# EAGLE design Driver_TS_switch_latch (EAGLE 9.2.2)
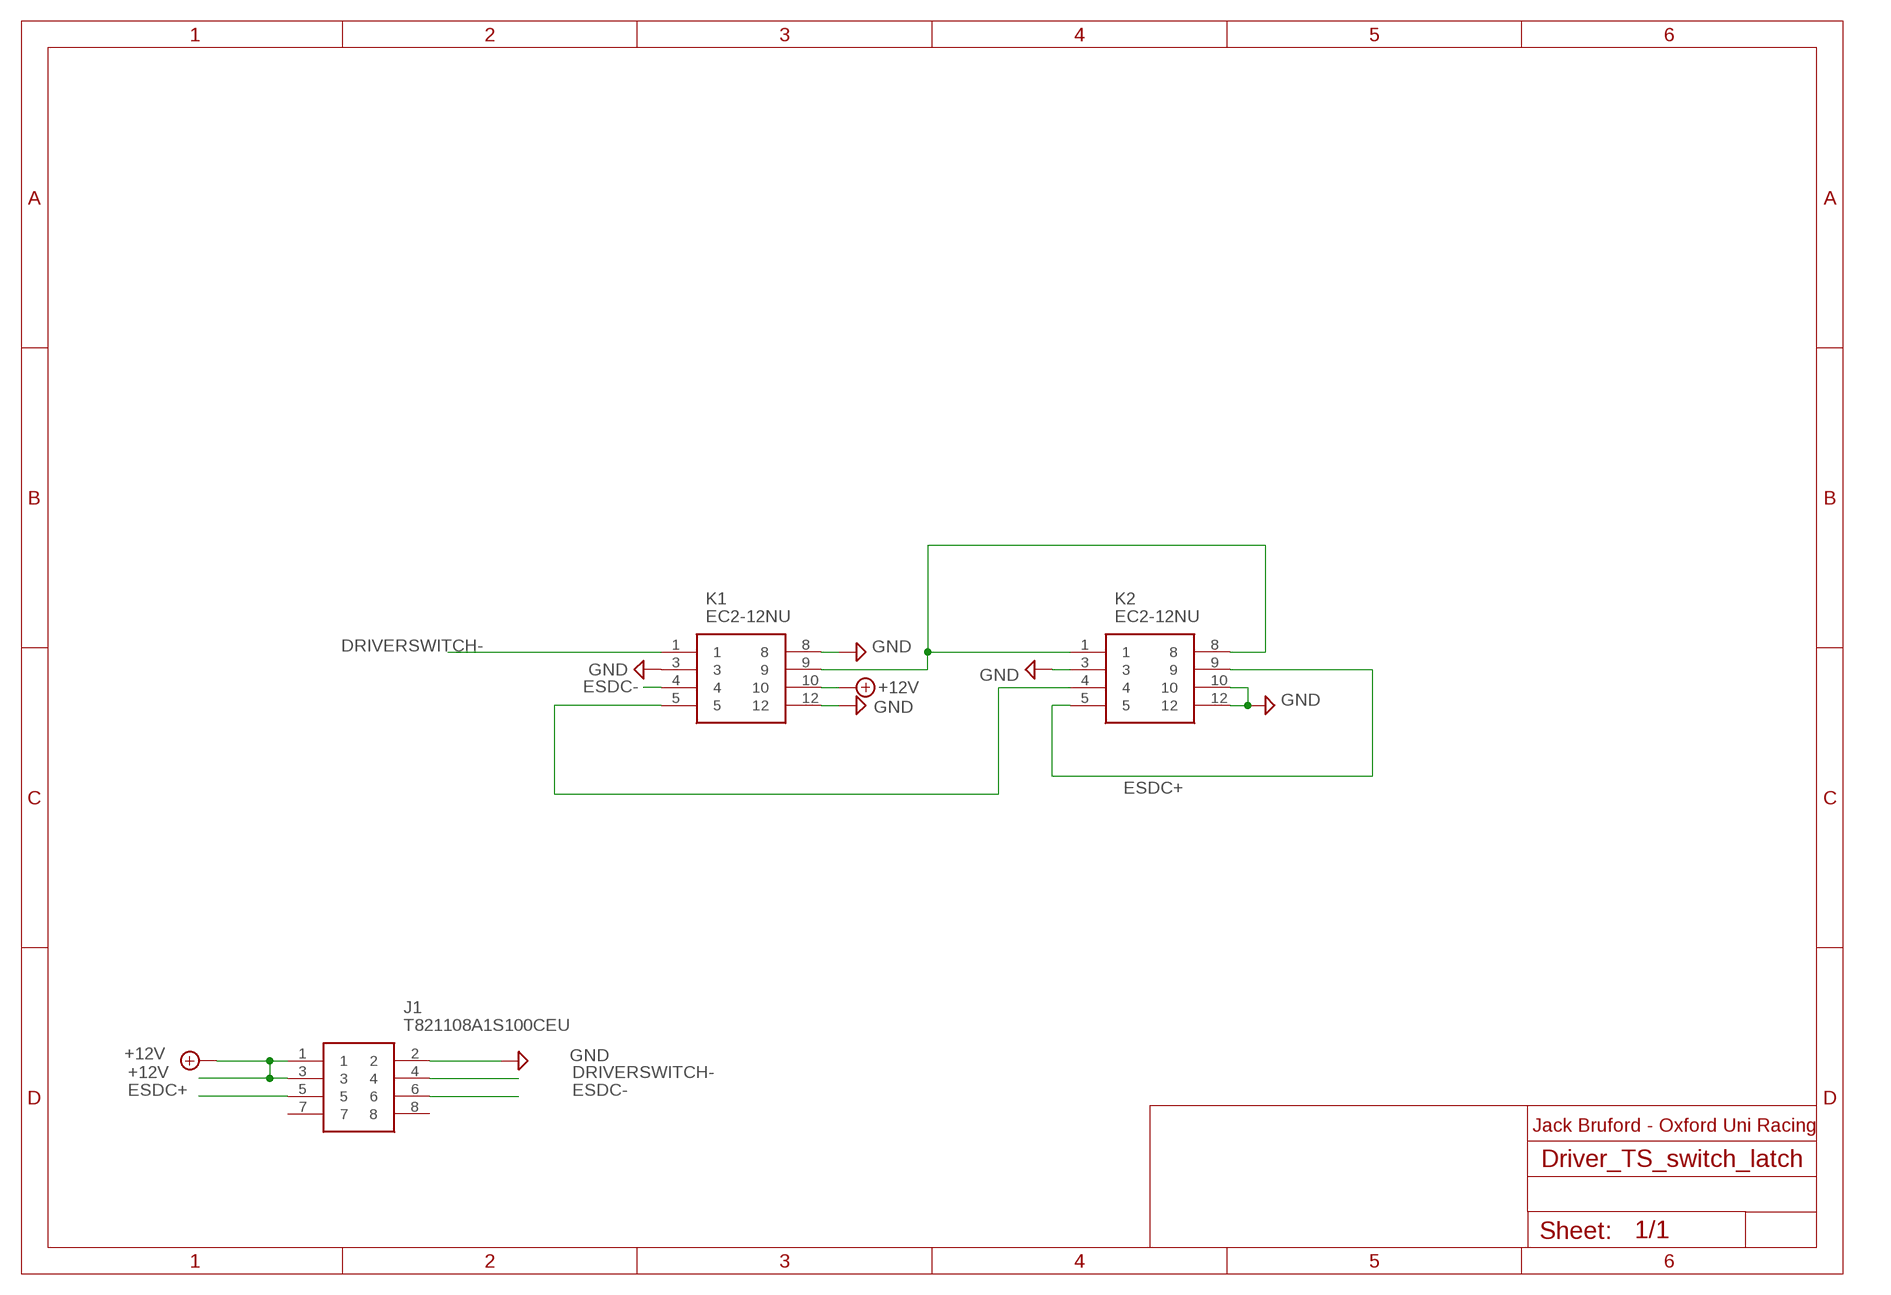
[diagram p0: schematic, sheet 1]

## Parts
J1  T821108A1S100CEU  [HDRV8W64P254_2X4_1778X895X915P]
K1  EC2-12NU  [EC2-12NU]
K2  EC2-12NU  [EC2-12NU]

## Nets
+12V: J1.1 J1.3 K1.10
DRIVERSWITCH-: J1.4 K1.1
ESDC+: J1.5 K2.5 K2.9
ESDC-: J1.6 K1.4
GND: J1.2 K1.3 K1.8 K1.12 K2.3 K2.10 K2.12
N$3: K1.5 K2.4
N$4: K1.9 K2.1 K2.8
Unconnected: J1.7 J1.8

## Notes on the sheet
- Jack Bruford - Oxford Uni Racing

## Library data of the parts
J1 = T821108A1S100CEU:T821108A1S100CEU: HEADER, VERTICAL, 2.54MM, 8WAY Amphenol T821 Series, 2.54mm Pitch 8 Way 2 Row Straight PCB Header, Solder Termination, 3A Source: Datasheet <http://uk.rs-online.com/web/p/products/1702738>; DESCRIPTION: HEADER, VERTICAL, 2.54MM, 8WAY Amphenol T821 Series, 2.54mm Pitch 8 Way 2 Row Straight PCB Header, Solder Termination, 3A; HEIGHT: 9.15mm; MANUFACTURER_NAME: Amphenol; MANUFACTURER_PART_NUMBER: T821108A1S100CEU; RS_PART_NUMBER: 1702738
K1 K2 = SamacSys_Parts:EC2-12NU: DPDT PCB Mount Non-Latching Relay 2 A, 12V dc Source: Datasheet <https://componentsearchengine.com/Datasheets/1/EC2-12NU.pdf>; DESCRIPTION: DPDT PCB Mount Non-Latching Relay 2 A, 12V dc; HEIGHT: mm; MANUFACTURER_NAME: Kemet; MANUFACTURER_PART_NUMBER: EC2-12NU; MOUSER_PART_NUMBER: 80-EC2-12NU

## Board
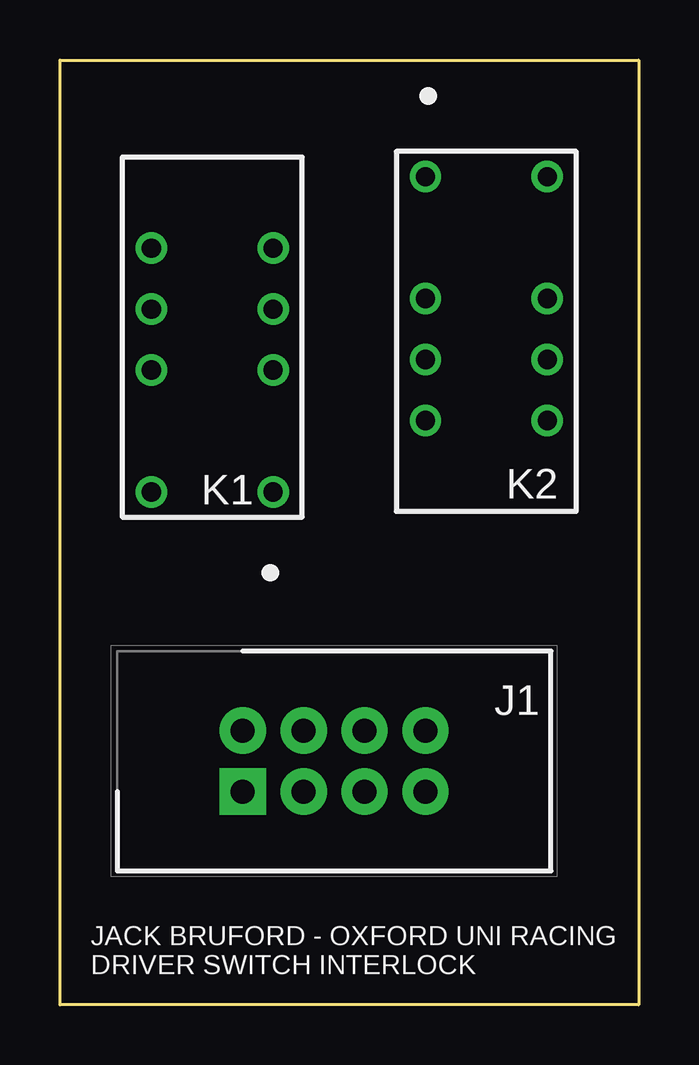
[diagram p1: board, top side]
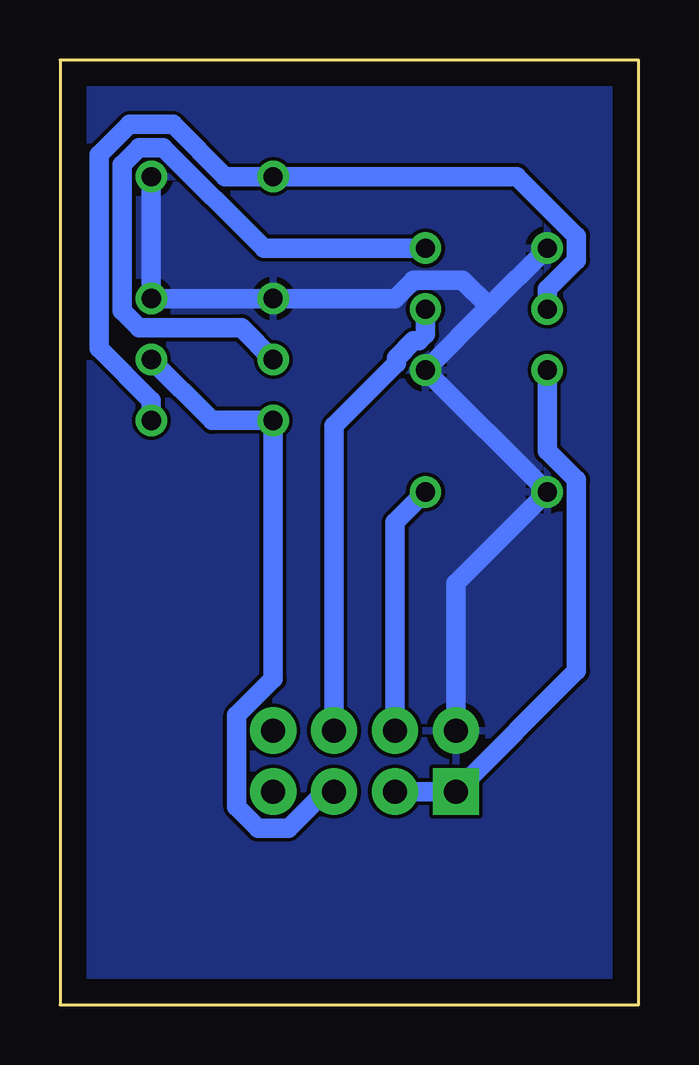
[diagram p2: board, bottom side, seen from below]

Size 24.13 x 39.37 mm. Coordinates in mm from the lower left corner, seen from the top.
Outline: 0,0 0,39.37 24.13,39.37 24.13,0 0,0
Copper layers (1*16): Top 0.035mm / dielectric 1.5mm / Bottom 0.035mm
Design rules "default": minimum track width 6mil, minimum drill 0.35mm, track to track 6mil, track to pad 6mil, pad to pad 6mil, via to via 6mil, smd to smd 6mil, copper to edge 40mil, drill to drill 6mil, minimum pad ring 10mil, minimum via ring 8mil, stop-mask expansion 4mil, vias tented up to drill 0mil, thermal gap 10mil

### Footprints (pad centres in the part's own frame; a part is rotated, then mirrored left to right if it is on the bottom)
HDRV8W64P254_2X4_1778X895X915P = drill 1 pad 1.93 square: 1 0,0 | drill 1 pad 1.93: 2 0,2.54; 3 2.54,0; 4 2.54,2.54; 5 5.08,0; 6 5.08,2.54; 7 7.62,0; 8 7.62,2.54
EC2-12NU = drill 0.8 pad 1.3: 1 1.05,-2.54; 3 6.13,-2.54; 4 8.67,-2.54; 5 11.21,-2.54; 8 11.21,2.54; 9 8.67,2.54; 10 6.13,2.54; 12 1.05,2.54

### Placement (x,y rotation side)
J1  7.62,8.89 0 top
K1  6.35,20.32 90 top
K2  17.78,35.56 270 top

### Tracks (layer width: path | path; a pad name or v marks a point on that pad's centre or on a via)
+12V
  Bottom 0.813: K1.10 3.81,23.09 2.6,21.87 2.6,13.91 J1.1 J1.3
DRIVERSWITCH-
  Bottom 0.813: K1.1 10.16,20.1 J1.4
ESDC+
  Bottom 0.813: K2.9 17.78,24.35 K2.5 15.24,13.59 16.76,12.06 16.76,8.26 15.87,7.37 14.61,7.37 13.09,8.89 J1.5
ESDC-
  Bottom 0.813: J1.6 12.7,24.13 10.1,26.73 10.1,26.95 9.39,27.66 9.17,27.66 8.89,27.94 K1.4
GND
  Bottom 0.813: K1.8 6.24,29.1 | 6.24,29.1 K1.3 K1.12 7.62,17.56 J1.2 | K2.12 K2.10 K2.3 10.16,29.43 9.39,30.2 7.34,30.2 6.24,29.1
  pour Bottom: 0,0 24.13,0 24.13,39.37 0,39.37
N$3
  Bottom 0.813: K2.4 16.57,28.22 20.82,28.22 21.53,28.93 21.53,35.01 20.82,35.72 19.82,35.72 15.62,31.53 K1.5
N$4
  Bottom 0.813: K2.8 20.32,25.18 22.5,27.35 22.5,35.41 21.22,36.69 19.42,36.69 17.24,34.51 K2.1 5.08,34.51 2.6,32.03 2.6,31.03 3.81,29.82 K1.9

### Text on the board
tPlace: JACK BRUFORD - OXFORD UNI RACING / DRIVER SWITCH INTERLOCK